# EAGLE design TPDH-Walrus_4pinPTH (EAGLE 9.4.2)
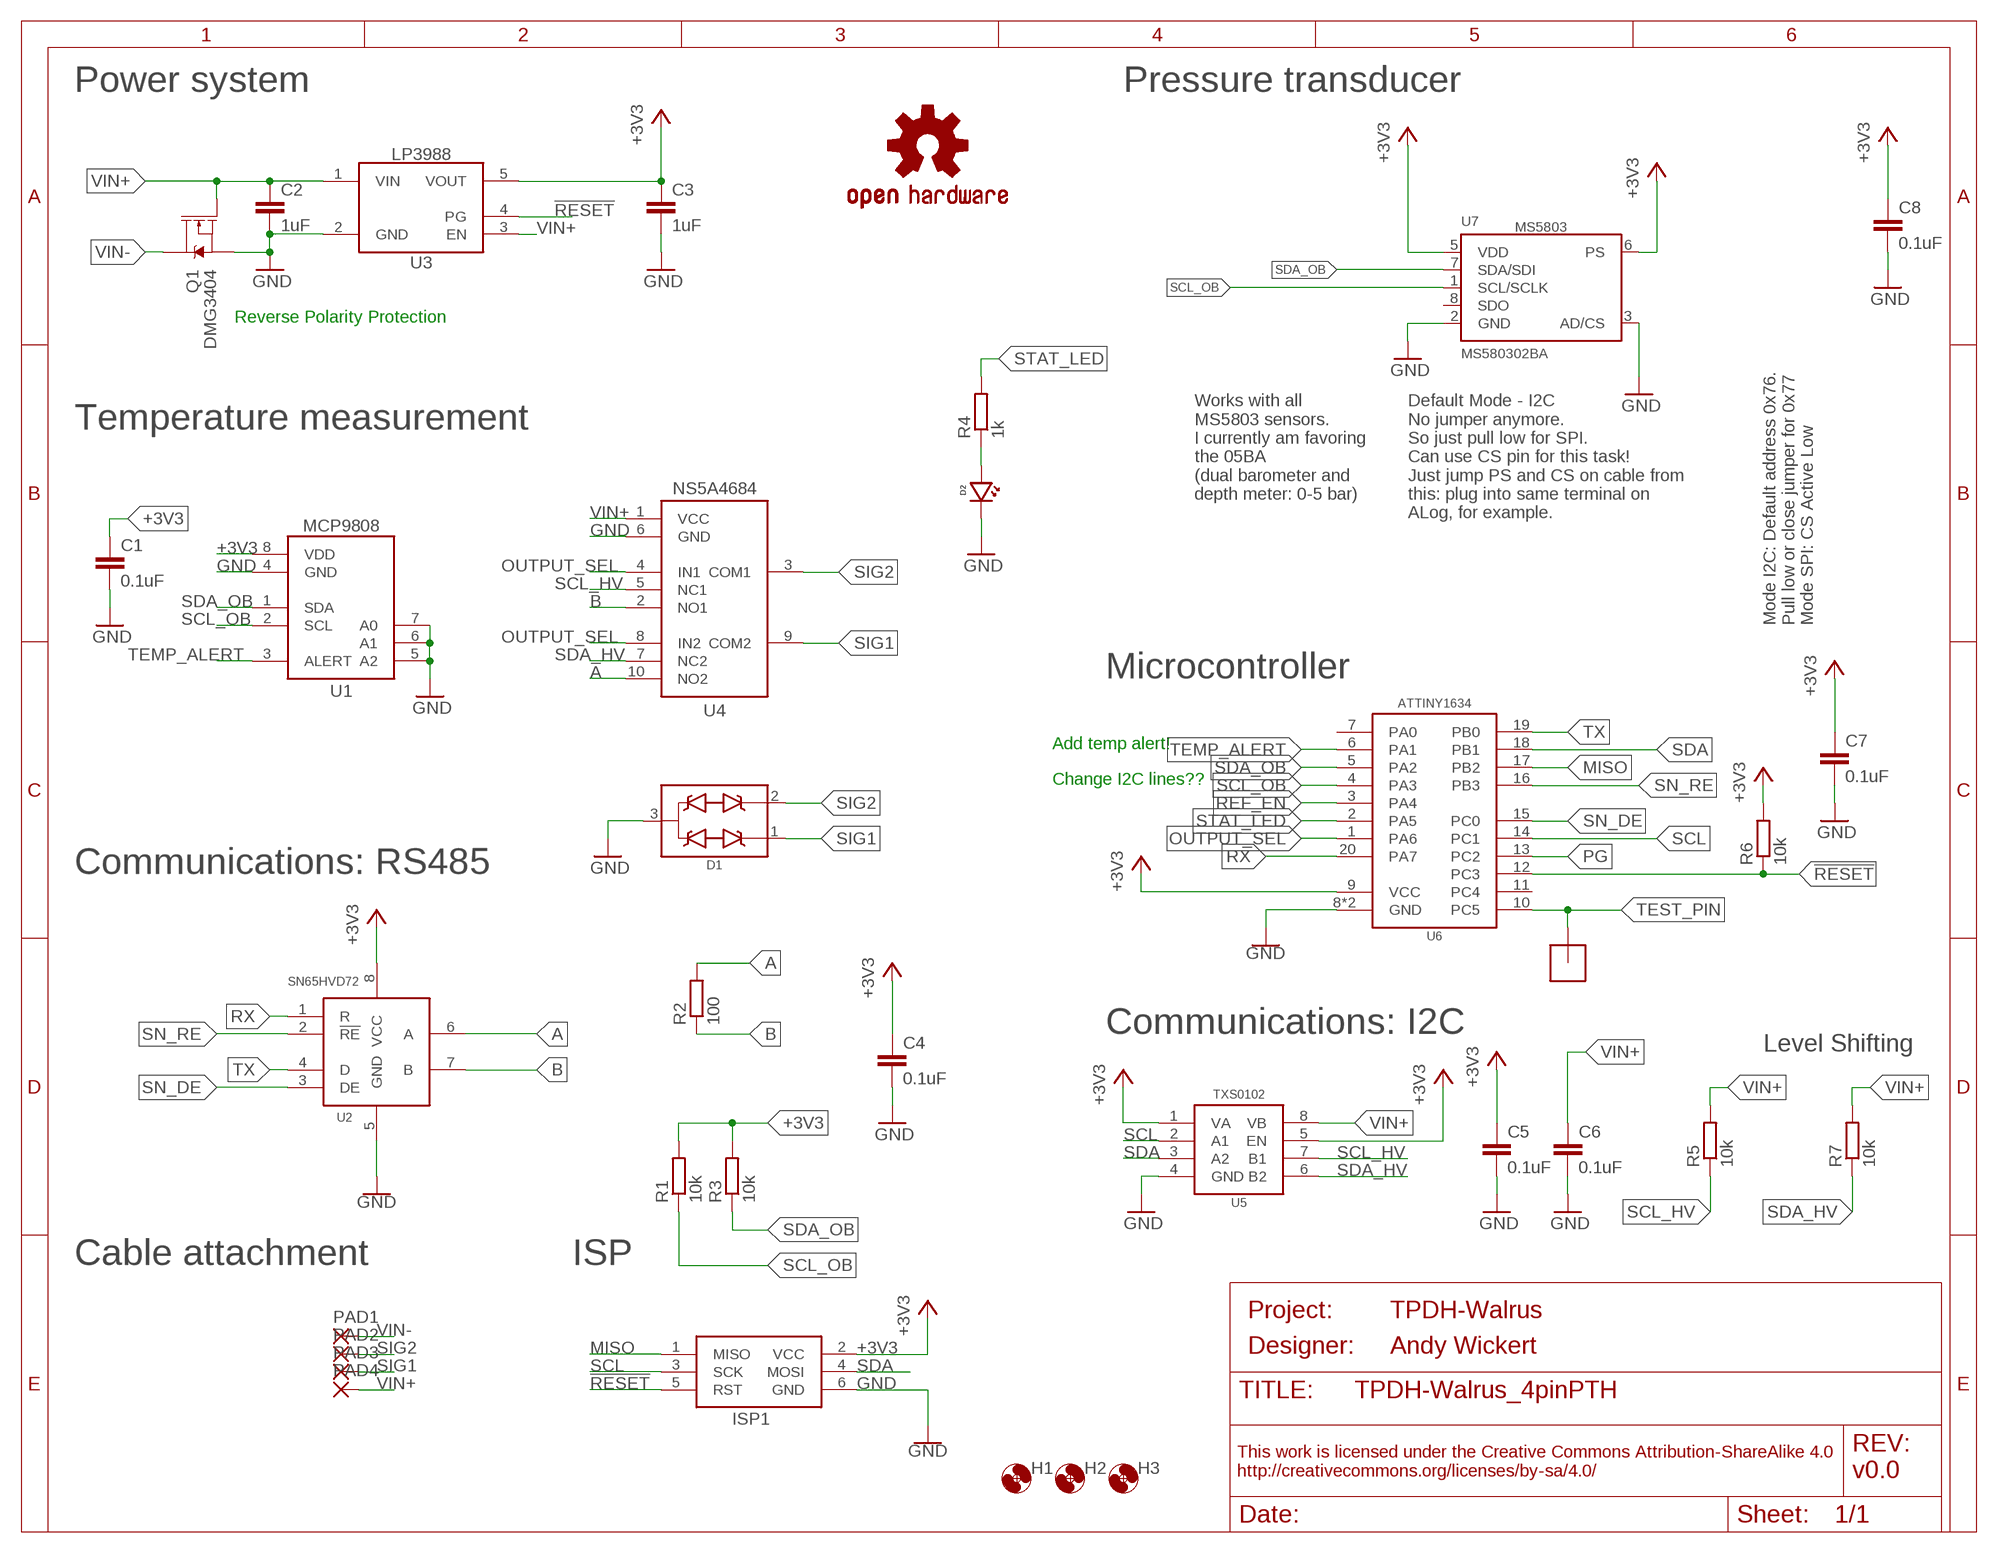
[diagram p0: schematic, sheet 1]
FRAME1 (FRAME_A_L): DESIGNER: Andy Wickert; PROJECT: TPDH-Walrus; REV: v0.0

## Parts
C1  0.1uF  C-EU0.1UFC0402  [C0402]
C2  1uF  C-EU1UFC0603  [C0603]
C3  1uF  C-EU1UFC0603  [C0603]
C4  0.1uF  C-EU0.1UFC0402  [C0402]
C5  0.1uF  C-EU0.1UFC0402  [C0402]
C6  0.1uF  C-EU0.1UFC0402  [C0402]
C7  0.1uF  C-EU0.1UFC0402  [C0402]
C8  0.1uF  C-EU0.1UFC0402  [C0402]
D1  TVSSM712  [SOT23-3]
D2  LEDBLUE0603  [LED_0603]
H1  MOUNTING_HOLE2_NP  [2_56]
H2  MOUNTING_HOLE2_NP  [2_56]
H3  MOUNTING_HOLE2_NP  [2_56]
ISP1  AVRISP-6  [AVRISP]
LOGO1  OSHW-LOGOM  [OSHW-LOGO-M]
PAD1  PAD1.1MM  [2,54/1,1]
PAD2  PAD1.1MM  [2,54/1,1]
PAD3  PAD1.1MM  [2,54/1,1]
PAD4  PAD1.1MM  [2,54/1,1]
Q1  DMG3404  MOSFET-NCH-DMG3404L  [SOT23-3]
R1  10k  R-EU_10KR0402  [R0402]
R2  100  R-EU_100R0402  [R0402]
R3  10k  R-EU_10KR0402  [R0402]
R4  1k  R-EU_1KR0603  [R0603]
R5  10k  R-EU_10KR0402  [R0402]
R6  10k  R-EU_10KR0402  [R0402]
R7  10k  R-EU_10KR0402  [R0402]
TP1  POGO_PAD  [POGO_PAD]
U1  MCP9808MSOP  [MSOP_8]
U2  SN65HVD72DSOIC  [SO08]
U3  LP39883.3VDBV  [DBV0005A]
U4  NS5A4684S  [WQFN10]
U5  TXS0102DQM  [DQM_R-PX2SON-N8]
U6  ATTINY1634QFN  [QFN20]
U7  MS580302BA  [MS5803]

## Nets
!RESET: ISP1.5(RST) R6.1 U3.4(PG) U6.12(PC3)
+3V3: C1.1 C3.1 C4.1 C5.1 C7.1 C8.1 ISP1.2(VCC) R1.2 R3.2 R6.2 U1.8(VDD) U2.8(VCC) U3.5(VOUT) U5.1(VA) U5.5(EN) U6.9(VCC) U7.5(VDD) U7.6(PS)
A: R2.2 U2.6(A) U4.10(NO2)
B: R2.1 U2.7(B) U4.2(NO1)
GND: C1.2 C2.2 C3.2 C4.2 C5.2 C6.2 C7.2 C8.2 D1.3(COM) D2.CATHODE ISP1.6(GND) Q1.2(S) U1.4(GND) U1.5(A2) U1.6(A1) U1.7(A0) U2.5(GND) U3.2(GND) U4.6(GND) U5.4(GND) U6.8(GND) U6.EP(GND) U7.2(GND) U7.3(AD/CS)
MISO: ISP1.1(MISO) U6.17(PB2)
N$2: D2.ANODE R4.1
OUTPUT_SEL: U4.4(IN1) U4.8(IN2) U6.1(PA6)
PG: U6.13(PC2)
REF_EN: U6.3(PA4)
RX: U2.1(R) U6.20(PA7)
SCL: ISP1.3(SCK) U5.2(A1) U6.14(PC1)
SCL_HV: R5.1 U4.5(NC1) U5.7(B1)
SCL_OB: R1.1 U1.2(SCL) U6.4(PA3) U7.1(SCL/SCLK)
SDA: ISP1.4(MOSI) U5.3(A2) U6.18(PB1)
SDA_HV: R7.1 U4.7(NC2) U5.6(B2)
SDA_OB: R3.1 U1.1(SDA) U6.5(PA2) U7.7(SDA/SDI)
SIG1: D1.1(D1) PAD3.1(P) U4.9(COM2)
SIG2: D1.2(D2) PAD2.1(P) U4.3(COM1)
SN_DE: U2.3(DE) U6.15(PC0)
SN_RE: U2.2(!RE) U6.16(PB3)
STAT_LED: R4.2 U6.2(PA5)
TEMP_ALERT: U1.3(ALERT) U6.6(PA1)
TEST_PIN: TP1.P$1 U6.10(PC5)
TX: U2.4(D) U6.19(PB0)
VIN+: C2.1 C6.1 PAD4.1(P) Q1.1(G) R5.2 R7.2 U3.1(VIN) U3.3(EN) U4.1(VCC) U5.8(VB)
VIN-: PAD1.1(P) Q1.3(D)
Unconnected: U6.7(PA0) U6.11(PC4) U7.8(SDO)

## Notes on the sheet
- Power system | Pressure transducer
- Reverse Polarity Protection
- Works with all
  MS5803 sensors.
  I currently am favoring
  the 05BA
  (dual barometer and
  depth meter: 0-5 bar)
- Default Mode - I2C
  No jumper anymore.
  So just pull low for SPI.
  Can use CS pin for this task!
  Just jump PS and CS on cable from
  this: plug into same terminal on
  ALog, for example.
- Temperature measurement
- Mode I2C: Default address 0x76.
  Pull low or close jumper for 0x77
  Mode SPI: CS Active Low
- Microcontroller
- Add temp alert!
- Change I2C lines??
- Communications: RS485
- Communications: I2C
- Level Shifting
- Cable attachment | ISP

## Library data of the parts
C1 C4-C8 = bschulz_passives:C-EU: CAPACITOR, European symbol; DIGIKEY: 490-4759-1-ND; MF: Murata; MPN: GCM155R71C104KA55D
C2 C3 = bschulz:C-EU: CAPACITOR, European symbol; DIGIKEY: 1276-6524-1-ND; MF: Samsung; MPN: 1276-6524-1-ND
D1 = bschulz:TVS: Generic dual channel TVS diode; DIGIKEY: CDSOT23-SM712CT-ND; MF: Bourns; MPN: CDSOT23-SM712
D2 = bschulz:LED: Genaric LED; DIGIKEY: 732-4966-1-ND; MF: Wurth; MPN: 150060BS75000
H1-H3 = bschulz:MOUNTING_HOLE: Genaric Mechanical Mounting Hole Hole diameter based on max body diameter + 15% Keepout ring is for diameter of socket cap screw (minimum required clearance) TPlace ring is for diameter of pan head screw (recomended clearance) Specifications: Socket Cap <http://fastener-express.com/fastener-technical/SocketscapSS-Alloy.pdf> Button Head Socket Cap <http://fastener-express.com/fastener-technical/Button-Socket-alloy.pdf> Pan Head <http://fastener-express.com/fastener-technical/pan-machine-Screws.pdf>
ISP1 = bschulz:AVRISP: AVR ISP HEADER Standard 6 pin header for AVR programming
LOGO1 = SparkFun-Aesthetics:OSHW-LOGO: Open-Source Hardware (OSHW) Logo This logo indicates the piece of hardware it is found on incorporates a OSHW license and/or adheres to the definition of open source hardware found here: http://freedomdefined.org/OSHW
PAD1-PAD4 = bschulz:PAD: THROUGH-HOLE PAD
Q1 = bschulz:MOSFET-NCH: N-channel MOSFETs Voltage controlled devices that allow control of high current outputs. SparkFun Products: SparkFun OpenScale <https://www.sparkfun.com/products/13261> SparkFun Digital Sandbox <https://www.sparkfun.com/products/12651> SparkFun Monster Moto Shield <https://www.sparkfun.com/products/10182> SparkFun MOSFET Power Controller <https://www.sparkfun.com/products/11214>; DIGIKEY: DMG3404L-7DICT-ND; MF: Diodes Incorporated; MPN: DMG3404L-7
R1 R3 R5-R7 = bschulz_passives:R-EU_: RESISTOR, European symbol Digikey Parts: Yageo, 0402 <https://www.digikey.com/products/en/resistors/chip-resistor-surface-mount/52?k=&pkeyword=&sf=0&FV=ffec1104%2Cfffc000d%2C1c0002%2C440067%2C1f140000%2Cffe00034%2C400004&quantity=&ColumnSort=0&page=1&stock=1&pageSize=25> Yageo, 0603 <https://www.digikey.com/products/en/resistors/chip-resistor-surface-mount/52?k=&pkeyword=&s=4356&s=47360&sf=0&FV=fffc000d%2C1c0002%2C142c040c%2C1f140000%2Cffe00034&quantity=10&ColumnSort=1000011&page=1&stock=1&pageSize=25> Panasonic, 0603 <https://www.digikey.com/products/en/resistors/chip-resistor-surface-mount/52?k=&pkeyword=&pv252=68&sf=0&FV=ffec373d%2C1c0002%2C142c040c%2C1f140000%2Cffe00034%2C80002%2Cc0001&quantity=&ColumnSort=0&page=1&stock=1&pageSize=25> Panasonic, precision, 0603 <https://www.digikey.com/products/en/resistors/chip-resistor-surface-mount/52?FV=ffec4907%2Cfffc000a%2Cc0172%2C142c040c%2C1f140000%2Cffe00034%2C1c0002&quantity=100&ColumnSort=2085&page=1&stock=1&pageSize=25> Panasonic, 0805 <https://www.digikey.com/products/en/resistors/chip-resistor-surface-mount/52?k=&pkeyword=&pv3=1&sf=0&FV=ffec373d%2C1c0002%2C1f140000%2Cffe00034%2C142c040d&quantity=&ColumnSort=0&page=1&stock=1&pageSize=25> Rohm, current sense <https://www.digikey.com/products/en/resistors/chip-resistor-surface-mount/52?k=&pkeyword=&pv3=1&sf=0&FV=ffecb688%2C1f140000%2Cffe00034%2C1c0002&quantity=&ColumnSort=0&page=1&stock=1&pageSize=25> Vishay, pulse proof automotive <https://www.digikey.com/products/en/resistors/chip-resistor-surface-mount/52?k=&pkeyword=&pv7=2&sf=0&FV=ffec5d6b%2Cffe00034%2C1f140000&quantity=&ColumnSort=0&page=1&stock=1&pageSize=25>; DIGIKEY: 311-10.0KLRCT-ND; MF: Yageo; MPN: RC0402FR-0710KL; VALUE_PART: 10k
R2 = bschulz_passives:R-EU_: RESISTOR, European symbol Digikey Parts: Yageo, 0402 <https://www.digikey.com/products/en/resistors/chip-resistor-surface-mount/52?k=&pkeyword=&sf=0&FV=ffec1104%2Cfffc000d%2C1c0002%2C440067%2C1f140000%2Cffe00034%2C400004&quantity=&ColumnSort=0&page=1&stock=1&pageSize=25> Yageo, 0603 <https://www.digikey.com/products/en/resistors/chip-resistor-surface-mount/52?k=&pkeyword=&s=4356&s=47360&sf=0&FV=fffc000d%2C1c0002%2C142c040c%2C1f140000%2Cffe00034&quantity=10&ColumnSort=1000011&page=1&stock=1&pageSize=25> Panasonic, 0603 <https://www.digikey.com/products/en/resistors/chip-resistor-surface-mount/52?k=&pkeyword=&pv252=68&sf=0&FV=ffec373d%2C1c0002%2C142c040c%2C1f140000%2Cffe00034%2C80002%2Cc0001&quantity=&ColumnSort=0&page=1&stock=1&pageSize=25> Panasonic, precision, 0603 <https://www.digikey.com/products/en/resistors/chip-resistor-surface-mount/52?FV=ffec4907%2Cfffc000a%2Cc0172%2C142c040c%2C1f140000%2Cffe00034%2C1c0002&quantity=100&ColumnSort=2085&page=1&stock=1&pageSize=25> Panasonic, 0805 <https://www.digikey.com/products/en/resistors/chip-resistor-surface-mount/52?k=&pkeyword=&pv3=1&sf=0&FV=ffec373d%2C1c0002%2C1f140000%2Cffe00034%2C142c040d&quantity=&ColumnSort=0&page=1&stock=1&pageSize=25> Rohm, current sense <https://www.digikey.com/products/en/resistors/chip-resistor-surface-mount/52?k=&pkeyword=&pv3=1&sf=0&FV=ffecb688%2C1f140000%2Cffe00034%2C1c0002&quantity=&ColumnSort=0&page=1&stock=1&pageSize=25> Vishay, pulse proof automotive <https://www.digikey.com/products/en/resistors/chip-resistor-surface-mount/52?k=&pkeyword=&pv7=2&sf=0&FV=ffec5d6b%2Cffe00034%2C1f140000&quantity=&ColumnSort=0&page=1&stock=1&pageSize=25>; DIGIKEY: 311-100LRCT-ND; MF: Yageo; MPN: RC0402FR-07100RL; VALUE_PART: 100
R4 = bschulz_passives:R-EU_: RESISTOR, European symbol Digikey Parts: Yageo, 0402 <https://www.digikey.com/products/en/resistors/chip-resistor-surface-mount/52?k=&pkeyword=&sf=0&FV=ffec1104%2Cfffc000d%2C1c0002%2C440067%2C1f140000%2Cffe00034%2C400004&quantity=&ColumnSort=0&page=1&stock=1&pageSize=25> Yageo, 0603 <https://www.digikey.com/products/en/resistors/chip-resistor-surface-mount/52?k=&pkeyword=&s=4356&s=47360&sf=0&FV=fffc000d%2C1c0002%2C142c040c%2C1f140000%2Cffe00034&quantity=10&ColumnSort=1000011&page=1&stock=1&pageSize=25> Panasonic, 0603 <https://www.digikey.com/products/en/resistors/chip-resistor-surface-mount/52?k=&pkeyword=&pv252=68&sf=0&FV=ffec373d%2C1c0002%2C142c040c%2C1f140000%2Cffe00034%2C80002%2Cc0001&quantity=&ColumnSort=0&page=1&stock=1&pageSize=25> Panasonic, precision, 0603 <https://www.digikey.com/products/en/resistors/chip-resistor-surface-mount/52?FV=ffec4907%2Cfffc000a%2Cc0172%2C142c040c%2C1f140000%2Cffe00034%2C1c0002&quantity=100&ColumnSort=2085&page=1&stock=1&pageSize=25> Panasonic, 0805 <https://www.digikey.com/products/en/resistors/chip-resistor-surface-mount/52?k=&pkeyword=&pv3=1&sf=0&FV=ffec373d%2C1c0002%2C1f140000%2Cffe00034%2C142c040d&quantity=&ColumnSort=0&page=1&stock=1&pageSize=25> Rohm, current sense <https://www.digikey.com/products/en/resistors/chip-resistor-surface-mount/52?k=&pkeyword=&pv3=1&sf=0&FV=ffecb688%2C1f140000%2Cffe00034%2C1c0002&quantity=&ColumnSort=0&page=1&stock=1&pageSize=25> Vishay, pulse proof automotive <https://www.digikey.com/products/en/resistors/chip-resistor-surface-mount/52?k=&pkeyword=&pv7=2&sf=0&FV=ffec5d6b%2Cffe00034%2C1f140000&quantity=&ColumnSort=0&page=1&stock=1&pageSize=25>; DIGIKEY: 311-1KLDCT-ND; MF: Yageo; MPN: AC0603FR-071KL; VALUE_PART: 1k
TP1 = bschulz:POGO_PAD: POGO Pad SMD pad for interfacing with POGO Pins
U1 = bschulz:MCP9808: MCP9808 - Digital Temperature Sensor Characteristics: VCC: 2.7~5.5V Operating Temperature: -40°C to 125°C Accuracy: ±0.25°C (-40 to +125°C) IQ: 200μA (0.1μA Shutdown) Resolution: 0.0625°C Digikey: MCP9808T-E/MSCT-ND (MSOP) <https://www.digikey.com/product-detail/en/microchip-technology/MCP9808T-E-MS/MCP9808T-E-MSCT-ND/5169548> MCP9808T-E/MCCT-ND (DFN) <https://www.digikey.com/product-detail/en/microchip-technology/MCP9808T-E-MC/MCP9808T-E-MCCT-ND/2802117>; DIGIKEY: MCP9808T-E/MSCT-ND; MF: Microchip; MPN: MCP9808T-E/MS
U2 = bschulz:SN65HVD72: SN65HVD72 - Half Duplex RS-485 Tranciver, with output enable Characteristics: VCC: 3~3.6V Operating Temperature: -40°C to 125°C Digikey: 296-39179-1-ND (D) <https://www.digikey.com/product-detail/en/texas-instruments/SN65HVD72DR/296-39179-1-ND/5143186>; DIGIKEY: 296-39179-1-ND; DISP: SN65HVD72; MF: TI; MPN: SN65HVD72DR
U3 = bschulz:LP3988: TPS7A05* - Ultra Low Power Ultra Low Dropout Linear Regulator with Power Good Characteristics: Vin: 2.5V ~ 6V Vout: 1.8, 2.5, 2.85, 3.3V fixed IQ: 85μA typ, 200μA max Voltage Accuracy: 2% typ, 3.5% max Output Current: 150 mA Operating Temperature: -40°C to 125°C Digikey: LP3988IMF-3.3/NOPBCT-ND (3.3V Fixed) <https://www.digikey.com/products/en/integrated-circuits-ics/pmic-voltage-regulators-linear/699?k=LP3988&k=&pkeyword=LP3988&sv=0&pv1779=50&sf=0&FV=1c0002%2Cffe002bb%2C1f140000&quantity=&ColumnSort=0&page=1&pageSize=25>; DIGIKEY: LP3988IMF-3.3/NOPBCT-ND; MF: TI; MPN: LP3988IMF-3.3/NOPB
U4 = bschulz:NS5A4684S: NS5A4684S - Dual Analog Multiplexer (1:2) Characteristics: VCC: 1.65~5.5V Operating Temperature: -40°C to 85°C Digikey: NS5A4684SMNTAGOSCT-ND (10-WFQFN) <https://www.digikey.com/product-detail/en/on-semiconductor/NS5A4684SMNTAG/NS5A4684SMNTAGOSCT-ND/9087458>; DIGIKEY: NS5A4684SMNTAGOSCT-ND; DISP: NS5A4684; MF: ON Semiconductor; MPN: NS5A4684SMNTAG
U5 = bschulz:TXS0102: TXS0102 - 2 Channel Bidirectional Voltage Level Translator Characteristics: Vcc: 1.65 ~ 3.6V (Port A), 2.3 ~ 5.5V (Port B) IQ: 14.4μA Output Current: 50mA Output Type: Open Drain/Push-Pull Operating Temperature: -40°C to 85°C Digikey: 296-28368-1-ND (DQE) <https://www.digikey.com/product-detail/en/texas-instruments/TXS0102DQER/296-28368-1-ND/2625893> 296-28435-1-ND (DQM) <https://www.digikey.com/product-detail/en/texas-instruments/TXS0102DQMR/296-28435-1-ND/2638910> 296-21931-1-ND (DCU) <https://www.digikey.com/product-detail/en/texas-instruments/TXS0102DCUR/296-21931-1-ND/1629284>; DIGIKEY: 296-28435-1-ND; MF: TI; MPN: TXS0102DQMR
U6 = bschulz:ATTINY1634: ATtiny1634 8 bit AVR Microcontroller Features: Vcc: 1.8 ~ 5.5V Clock: Up to 16MHz, Internal 8MHz FRC, 32kHz RC Flash Memory: 16K SRAM: 1K EEPROM: 256B ADC: 10b, 12 port USART: Yes, x2 SPI: Yes I2C: Yes, slave only Notes: 2 analog comp. Digikey: ATTINY1634R-MURCT-ND (QFN) <https://www.digikey.com/product-detail/en/microchip-technology/ATTINY1634R-MUR/ATTINY1634R-MURCT-ND/3440781> ATTINY1634R-SU-ND (SOIC) <https://www.digikey.com/product-detail/en/ATTINY1634R-SU/ATTINY1634R-SU-ND/3128699/?itemSeq=272981030>; DIGIKEY: ATTINY1634-MURCT-ND; MF: Atmel; MPN: ATTINY1634-MUR
U7 = bschulz:MS5803: MS5803 - Minature Media Compatible Pressure Sensor Characteristics: Vcc: 1.8V ~ 3.6V IQ: 1μA (0.15μA standby) Pressure Range: 10 ~ 1300 mBar (01BA model) Pressure Resolution: 0.0012 mBar, max (01BA model) Pressure Accuracy: relative ±1.5 mBar, abs ± 1 mBar Temperature Resolution: 0.01°C Temperature Accuracy: 0.8°C Operating Temperature: -40°C to 85°C Digikey: 223-1623-5-ND (01BA) <https://www.digikey.com/product-detail/en/te-connectivity-measurement-specialties/MS580301BA01-00/223-1623-5-ND/5277628> 223-1625-5-ND (05BA) <https://www.digikey.com/product-detail/en/te-connectivity-measurement-specialties/MS580305BA01-00/223-1625-5-ND/5277630>; DIGIKEY: 223-1625-5-ND; MF: TE; MPN: MS580305BA01-00

## Board
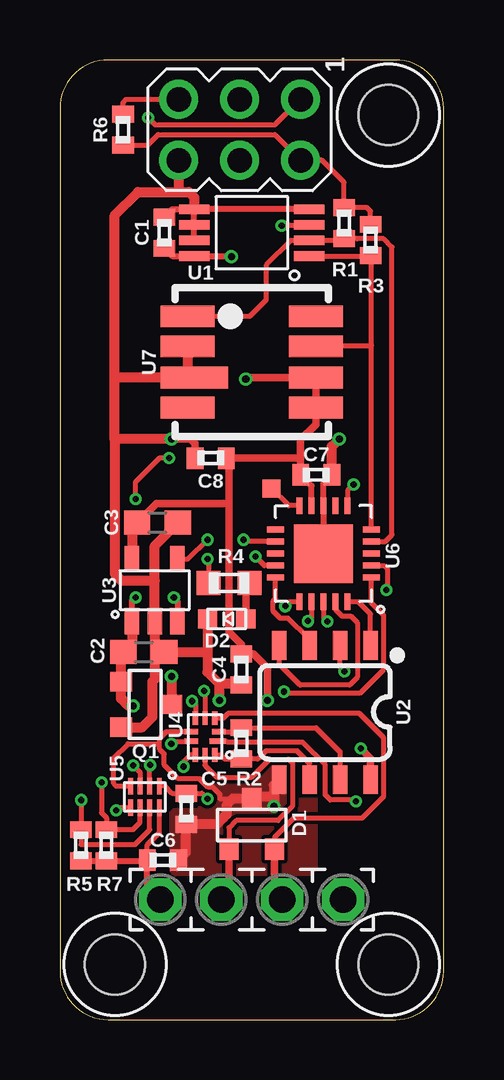
[diagram p1: board, top side]
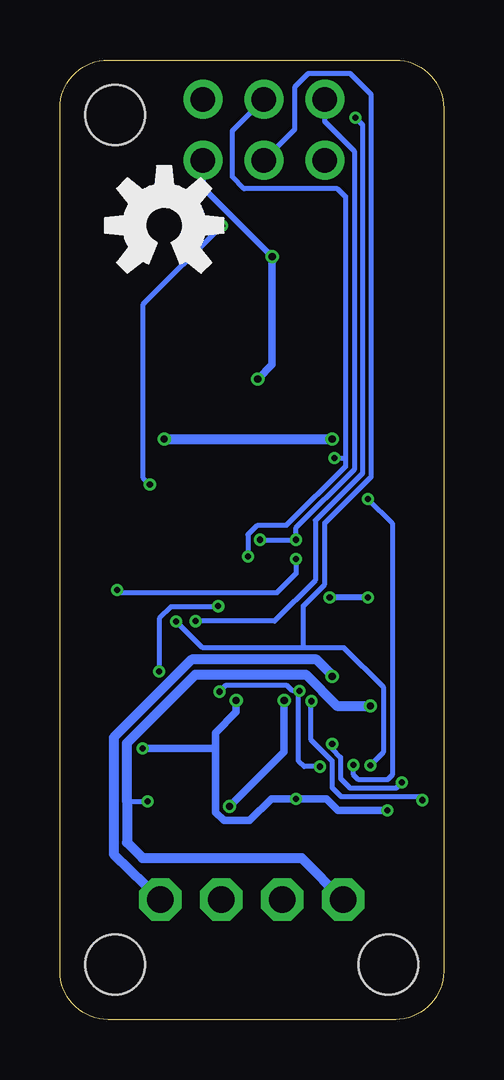
[diagram p2: board, bottom side, seen from below]

Size 16 x 40 mm. Coordinates in mm from the lower left corner, seen from the top.
Outline: 2,0 14,0 arc90 16,2 16,38 arc90 14,40 2,40 arc90 0,38 0,2 arc90 2,0
Copper layers (1*16): Top 0.035559375mm / dielectric 1.6mm / Bottom 0.035559375mm
Design rules "oshpark-2layer": minimum track width 6mil, minimum drill 10mil, track to track 6mil, track to pad 6mil, pad to pad 6mil, via to via 6mil, smd to smd 6mil, copper to edge 15mil, drill to drill 6mil, minimum pad ring 5mil, minimum via ring 5mil, stop-mask expansion 2.5mil, vias tented up to drill 0mil, thermal gap 10mil

### Footprints (pad centres in the part's own frame; a part is rotated, then mirrored left to right if it is on the bottom)
C0402 = smd 0.7 x 0.9: 1 -0.65,0; 2 0.65,0
C0603 = smd 1.1 x 1: 1 -0.85,0; 2 0.85,0
SOT23-3 = smd 0.8 x 0.9: 1 -0.95,-1; 2 0.95,-1; 3 0,1.1
LED_0603 = smd 0.8 x 0.8: ANODE 0.8,0; CATHODE -0.8,0
2_56 = hole 2.5: 0,0
AVRISP = drill 1.02 pad 1.626: 1 -1.27,2.54; 2 1.27,2.54; 3 -1.27,0; 4 1.27,0; 5 -1.27,-2.54; 6 1.27,-2.54
2,54/1,1 = drill 1.118 pad 1.778 octagon: 1 0,0
R0402 = smd 0.7 x 0.9: 1 -0.65,0; 2 0.65,0
R0603 = smd 1 x 1: 1 -0.85,0; 2 0.85,0
POGO_PAD = smd 0.75 x 0.75: P$1 0,0
MSOP_8 = smd 1.26 x 0.4: 1 -2.4,0.975; 2 -2.4,0.325; 3 -2.4,-0.325; 4 -2.4,-0.975; 5 2.4,-0.975; 6 2.4,-0.325; 7 2.4,0.325; 8 2.4,0.975
SO08 = smd 0.6 x 1.2: 1 -1.905,-2.8; 2 -0.635,-2.8; 3 0.635,-2.8; 4 1.905,-2.8; 5 1.905,2.8; 6 0.635,2.8; 7 -0.635,2.8; 8 -1.905,2.8
DBV0005A = smd 1.1 x 0.6: 1 -1.3,0.95; 2 -1.3,0; 3 -1.3,-0.95; 4 1.3,-0.95; 5 1.3,0.95
WQFN10 = smd 0.663 x 0.225: 1 -0.518,0.2 | smd 0.563 x 0.225: 2 -0.569,-0.2; 6 0.569,-0.2; 7 0.569,0.2 | smd 0.225 x 0.563: 3 -0.4,-0.768; 4 0,-0.768; 5 0.4,-0.768; 8 0.4,0.768; 9 0,0.768; 10 -0.4,0.768
DQM_R-PX2SON-N8 = smd 0.2 x 0.7: 1 -0.6,-0.45; 2 -0.2,-0.45; 3 0.2,-0.45; 4 0.6,-0.45; 5 0.6,0.45; 6 0.2,0.45; 7 -0.2,0.45; 8 -0.6,0.45
QFN20 = smd 0.7 x 0.25: 1 -2.032,0.968; 2 -2.032,0.468; 3 -2.032,-0.032; 4 -2.032,-0.532; 5 -2.032,-1.032; 11 1.968,-1.032; 12 1.968,-0.532; 13 1.968,-0.032; 14 1.968,0.468; 15 1.968,0.968 | smd 0.25 x 0.7: 6 -1.032,-2.032; 7 -0.532,-2.032; 8 -0.032,-2.032; 9 0.468,-2.032; 10 0.968,-2.032; 16 0.968,1.968; 17 0.468,1.968; 18 -0.032,1.968; 19 -0.532,1.968; 20 -1.032,1.968 | smd 2.45 x 2.45: EP -0.032,-0.032
MS5803 = smd 2.25 x 0.9: 1 -2.675,1.9; 2 -2.675,0.65; 4 -2.675,-1.9; 5 2.675,-1.9; 6 2.675,-0.65; 7 2.675,0.65; 8 2.675,1.9 | smd 2.8 x 0.9: 3 -2.4,-0.65

### Placement (x,y rotation side)
C1  4.35,32.8 90 top
C2  3.5,15.32 0 top
C3  4.07,20.71 0 top
C4  7.57,14.59 270 top
C5  5.28,8.78 270 top
C6  4.29,6.65 0 top
C7  10.69,22.7 0 top
C8  6.29,23.4 180 top
D1  8,8.1 0 top
D2  6.95,16.7 0 top
H1  13.7,37.7 0 top
H2  2.3,2.3 0 top
H3  13.7,2.3 0 top
ISP1  7.49,37.09 270 top
LOGO1  11.65,33.1 0 bottom
PAD1  11.81,5 0 top
PAD2  9.27,5 0 top
PAD3  6.73,5 0 top
PAD4  4.19,5 0 top
Q1  3.55,13.13 270 top
R1  11.85,33.2 90 top
R2  7.57,11.51 270 top
R3  12.95,32.5 90 top
R4  7.05,18.2 180 top
R5  0.88,7.27 270 top
R6  2.64,37.09 270 top
R7  1.93,7.27 270 top
TP1  8.83,22.14 0 top
U1  8,32.8 180 top
U2  11.05,12.8 180 top
U3  3.95,17.9 90 top
U4  6.05,11.8 180 top
U5  3.54,9.28 180 top
U6  10.96,19.39 180 top
U7  8,27.41 0 top

### Tracks (layer width: path | path; a pad name or v marks a point on that pad's centre or on a via)
!RESET  (via drill 0.25)
  Top 0.2: v6.15,20 5.35,19.2 U3.4 | U6.12 7.73,19.92 v7.65,20 | R6.1 2.64,38.25 2.75,38.36 ISP1.5
  Bottom 0.2: v7.65,20 v6.15,20 6.15,20.5 3.73,22.93 3.73,36.2 4.95,37.43 ISP1.5
+3V3  (via drill 0.25, 0.3)
  Top 0.2: 12.96,9.8 U2.8 | U5.1 4.38,9.73 4.67,9.43 C5.1 5.92,9.43 v6.15,9.2 | U5.5 2.46,8.83 v2.35,8.72 | R3.2 12.95,33.7 12.8,33.85 R1.2 11.85,34.9 10.93,35.82 ISP1.2 8.97,36.89 4.1,36.89 3.65,36.44 R6.2
  Top 0.254: C1.1 4.67,31.82 U1.8 7.12,31.82 v7.15,31.8 | U6.9 10.49,22.25 C7.1
  Top 0.305: v12.55,11.3 12.96,10.89 12.96,9.8 | C7.1 10.04,23.5 | 10.04,23.5 10.04,24.17 10.68,24.81 U7.5 U7.6 7.81,26.76 v7.75,26.7 | 10.04,23.5 9.94,23.4 C8.1 7.04,23.3 7.04,21.5 | C3.1 4.02,21.52 7.03,21.52 7.04,21.5 | v8.65,13.3 8.65,14.66 8.07,15.24 C4.1 7.57,15.64 7.04,16.17 7.04,21.5
  Top 0.406: C3.1 3,20.5 U3.5
  Bottom 0.254: v7.15,31.8 10.03,34.68 ISP1.2
  Bottom 0.305: v7.15,31.8 7.15,27.3 v7.75,26.7 | v2.35,8.72 4.4,8.72 4.88,9.2 v6.15,9.2 7.18,9.2 8.08,8.3 9.17,8.3 9.51,8.64 9.51,11.3 | 9.51,11.3 9.51,11.96 8.65,12.81 v8.65,13.3 | v12.55,11.3 9.51,11.3
A
  Top 0.2: U4.10 6.7,11.03 6.87,10.86 R2.2 8.25,10.86 8.59,11.21 9.9,11.21 10.41,10.69 U2.6
B
  Top 0.2: U4.2 7.41,12 R2.1 10.69,12.16 11.69,11.16 U2.7
GND  (via drill 0.3)
  Top 0.2: U5.4 2.34,9.73 2.24,9.83 2.24,10.91 2.83,11.5 4.14,11.5 | 7.65,9.2 6.67,9.2 6.66,9.21 6.66,9.41 6.36,9.71 6.16,9.71 5.83,10.04 4.93,10.04 4.35,10.62 4.35,11.07 4.14,11.28 4.14,11.5 | U4.6 4.43,12 4.14,11.7 4.14,11.5
  Top 0.254: C1.2 4.67,33.77 U1.5 | U1.7 U1.6 U1.5 | U1.4 U1.5 | C7.2 10.99,22.36 U6.8 U6.EP
  Top 0.305: C4.2 7.49,13.94 | v4.65,24.2 5.44,24.2 5.64,24 C8.2
  Top 0.406: C7.2 11.34,23.89 v11.65,24.2 | v4.65,24.2 2.31,24.2 2.31,24.13 | U7.2 5.33,27.04 U7.3 2.32,26.76 2.29,26.8 | C6.2 5.24,6.95 5.24,8.13 C5.2 6.54,8.13 6.95,8.54 6.95,8.94 7.21,9.2 7.65,9.2 D1.3 8.1,9.3 8.93,9.3 | ISP1.6 4.95,34.5 | 4.95,34.5 3.25,34.5 2.29,33.53 2.29,26.8 | U2.5 8.93,9.78 8.93,9.3 | 8.93,9.3 v8.93,8.88 | Q1.2 3.44,12.19 3.84,12.59 3.84,14.08 3.95,14.19 3.95,15.3 | 4.35,15.3 C2.2 | 2.31,24.13 2.31,18.54 2.55,18.29 3.94,18.29 3.95,18.3 | C3.2 3.95,19.75 3.95,18.3 | 3.95,18.3 U3.2 3.95,15.3 | v6.65,13.3 6.65,13.98 | D2.CATHODE 6.15,15.3 | 6.15,15.3 6.15,14.48 6.65,13.98 | 6.15,15.3 6.13,15.32 C2.2 | C4.2 7.53,13.98 6.65,13.98 | C2.2 3.97,15.32 3.95,15.3 | 4.95,34.5 5.38,34.5 5.6,34.28 U1.5 | 2.31,24.13 2.29,24.16 2.29,26.8
  Bottom 0.305: v8.93,8.88 6.65,11.16 v6.65,13.3
  Bottom 0.406: v11.65,24.2 v4.65,24.2
  pour Top (no thermals): 8.05,10.1 6.85,10.1 5.85,9.1 5.85,8.8 5.75,8.7 4.75,8.7 4.65,8.6 4.65,6.22 4.77,6.1 10.45,6.1 10.65,6.3 10.65,10.1 9.95,10.8 8.75,10.8
MISO  (via drill 0.25)
  Top 0.2: U6.17 10.49,16.75 v10.35,16.61 | v3.68,37.59 3.98,37.3 8.97,37.3 ISP1.1
  Bottom 0.2: v10.35,16.61 7.04,16.61 5.34,18.3 5.34,20.81 3.37,22.78 3.37,37.28 v3.68,37.59
N$2
  Top 0.305: R4.1 7.75,18.05 D2.ANODE
OUTPUT_SEL  (via drill 0.25)
  Top 0.2: U4.8 5.45,11.03 5.16,10.74 v5.16,10.54 | U4.4 6.06,13.65 v6.01,13.7 | U6.1 12.99,17.36 13.51,16.85 13.51,14.6 12.51,13.6 9.42,13.6 v9.35,13.67
  Bottom 0.2: v5.16,10.54 5.81,10.54 6.06,10.79 6.06,13.65 v6.01,13.7 6.3,13.7 6.52,13.92 9.1,13.92 v9.35,13.67
PG
  Top 0.2: 8.98,19.41 U6.13
RX
  Top 0.2: U2.1 12.96,16.9 12.44,17.42 U6.20
SCL  (via drill 0.25)
  Top 0.2: U6.14 8.53,18.92 v8.15,19.3 | v4.55,23.4 4.15,23.4 3.15,22.4 v3.15,21.7 | U5.2 3.74,10.59 v3.76,10.61
  Bottom 0.2: ISP1.3 8.81,37.04 8.81,35.13 8.31,34.63 4.42,34.63 4.08,34.29 4.08,23.4 | 4.08,23.4 4.08,23.07 6.54,20.61 7.76,20.61 8.16,20.21 v8.16,19.31 v8.15,19.3 | v3.15,21.7 2.14,20.69 2.14,10.19 2.33,10 3.55,10 3.76,10.21 v3.76,10.61 | v4.55,23.4 4.08,23.4
SCL_HV  (via drill 0.25)
  Top 0.2: U5.7 3.74,7.91 3.14,7.3 0.88,7.3 0.88,7.87 | v5.51,13.27 5.65,13.13 U4.5 | R5.1 0.88,7.87 | v0.89,9.14 0.89,7.89 0.88,7.87
  Bottom 0.2: v5.51,13.27 5.55,13.23 5.55,11.68 4.65,10.78 4.65,9.67 4.27,9.29 1.04,9.29 v0.89,9.14
SCL_OB
  Top 0.2: U6.4 13.57,19.92 13.85,20.2 13.85,32.2 13.5,32.55 12.39,32.55 R1.1 11.78,32.48 10.55,32.48 | 10.57,32.5 U1.2 10.55,32.48 | 10.55,32.48 9.63,32.48 8.6,31.45 8.6,30 7.91,29.31 U7.1
SDA  (via drill 0.25)
  Top 0.2: v3.05,10.6 3.34,10.31 U5.3 | U6.18 10.99,16.76 v11.15,16.6
  Bottom 0.2: v11.15,16.6 10.05,15.5 5.85,15.5 | 5.85,15.5 4.15,15.5 2.52,13.87 2.52,11.13 v3.05,10.6 | 5.85,15.5 5.85,17.24 4.95,18.14 4.95,20.7 3.02,22.63 3.02,38.56 3.89,39.43 5.65,39.43 6.22,38.86 6.22,37.1 ISP1.4
SDA_HV  (via drill 0.25)
  Top 0.2: v4.64,11.49 4.75,11.6 U4.7 | U5.6 3.34,8.21 3.05,7.92 R7.1 1.94,8.41 1.74,8.62 v1.74,9.88
  Bottom 0.2: v4.64,11.49 4.64,11.28 4.3,10.93 4.3,10.04 3.9,9.65 1.97,9.65 v1.74,9.88
SDA_OB
  Top 0.2: U6.5 12.99,28.1 | 12.99,28.1 12.99,31.81 R3.1 12.93,31.82 U1.1 | U7.7 10.72,28.1 12.99,28.1
SIG1
  Top 0.2: U4.9 6.05,10.6 6.55,10.1 7.99,10.1 8.74,10.85 9.55,10.85 9.7,10.71 9.7,8.89 9.1,8.3 7.35,8.3 7.05,8 D1.1
  Top 0.305: D1.1 7.05,5.32 PAD3.1
SIG2
  Top 0.2: U4.3 6.82,12.57 7.01,12.77 12.48,12.77 13.51,11.74 13.51,9.29 12.61,8.4 9.75,8.4 8.95,7.6 D1.2
  Top 0.305: D1.2 8.95,5.32 PAD2.1
SN_DE
  Top 0.2: U2.3 10.41,15.9 10.34,15.9 9.51,16.73 9.19,16.73 8.89,17.02 8.89,17.44 8.99,17.54 U6.15
SN_RE  (via drill 0.25)
  Top 0.2: v9.4,17.23 9.59,17.42 U6.16 | v11.86,14.51 11.69,14.69 U2.2
  Bottom 0.2: v9.4,17.23 9.42,17.21 11.35,17.21 11.86,16.71 v11.86,14.52 v11.86,14.51
STAT_LED  (via drill 0.25)
  Top 0.2: U6.2 13.53,18.92 13.65,18.8 13.65,17.93 v13.62,17.9 | v6.15,19.2 6.2,19.15 R4.2
  Bottom 0.2: v13.62,17.9 13.51,17.79 6.94,17.79 6.15,18.58 v6.15,19.2
TEMP_ALERT  (via drill 0.25)
  Top 0.2: v12.25,22.3 11.99,22.04 U6.6 | U1.3 10.38,33.1 v9.25,33.1
  Bottom 0.2: v9.25,33.1 12.55,29.8 12.55,22.6 v12.25,22.3
TEST_PIN
  Top 0.2: U6.10 9.54,21.42 TP1.P$1
TX
  Top 0.2: U2.4 9.14,14.81 10.01,13.95 12.09,13.95 12.4,14.26 12.4,16.55 12.13,16.82 11.76,16.82 11.49,17.09 U6.19
VIN+  (via drill 0.25, 0.3)
  Top 0.2: U5.8 4.14,7.79 3.64,7.29 C6.1 | v12.35,9.1 12.3,9.15 11.28,9.15 11.07,9.36 11.07,10.61 10.12,11.56 6.97,11.56 6.93,11.6 U4.1
  Top 0.254: U3.1 3,17.45 v3.15,17.6 | v4.75,17.6 4.9,17.45 U3.3 | R5.2 R7.2 3.61,6.62 C6.1 3.64,5.55 PAD4.1
  Top 0.406: v3.05,13.08 2.85,13.08 2.55,13.38 Q1.1 2.55,15.21 C2.1 3,15.66 U3.1
  Bottom 0.2: 13.2,9.1 v12.35,9.1
  Bottom 0.254: v3.15,17.6 v4.75,17.6
  Bottom 0.406: v3.05,13.08 4.45,13.08 5.75,14.38 10.35,14.38 13.2,11.52 13.2,9.1 13.2,7.38 12.55,6.73 5.92,6.73 PAD4.1
VIN-  (via drill 0.3)
  Top 0.406: v4.65,14.3 Q1.3
  Bottom 0.406: v4.65,14.3 4.65,14.36 5.3,15.01 10.5,15.01 13.76,11.75 13.76,6.89 PAD1.1

### Text on the board
Reference: Andrew D. Wickert
tDocu: Walrus v0.2 | Northern Widget | V+ | V- | SIG1 | SIG2
bDocu: Project-TPDH-Walrus / v0.2.0 / 09-26-2019 / / Based on TP-Downhole by / Schulz, Sandell, Wickert / / A. Wickert & B. Schulz / / Northern Widget LLC / and University of Minnesota